# Altium project Main Board.PrjPcb
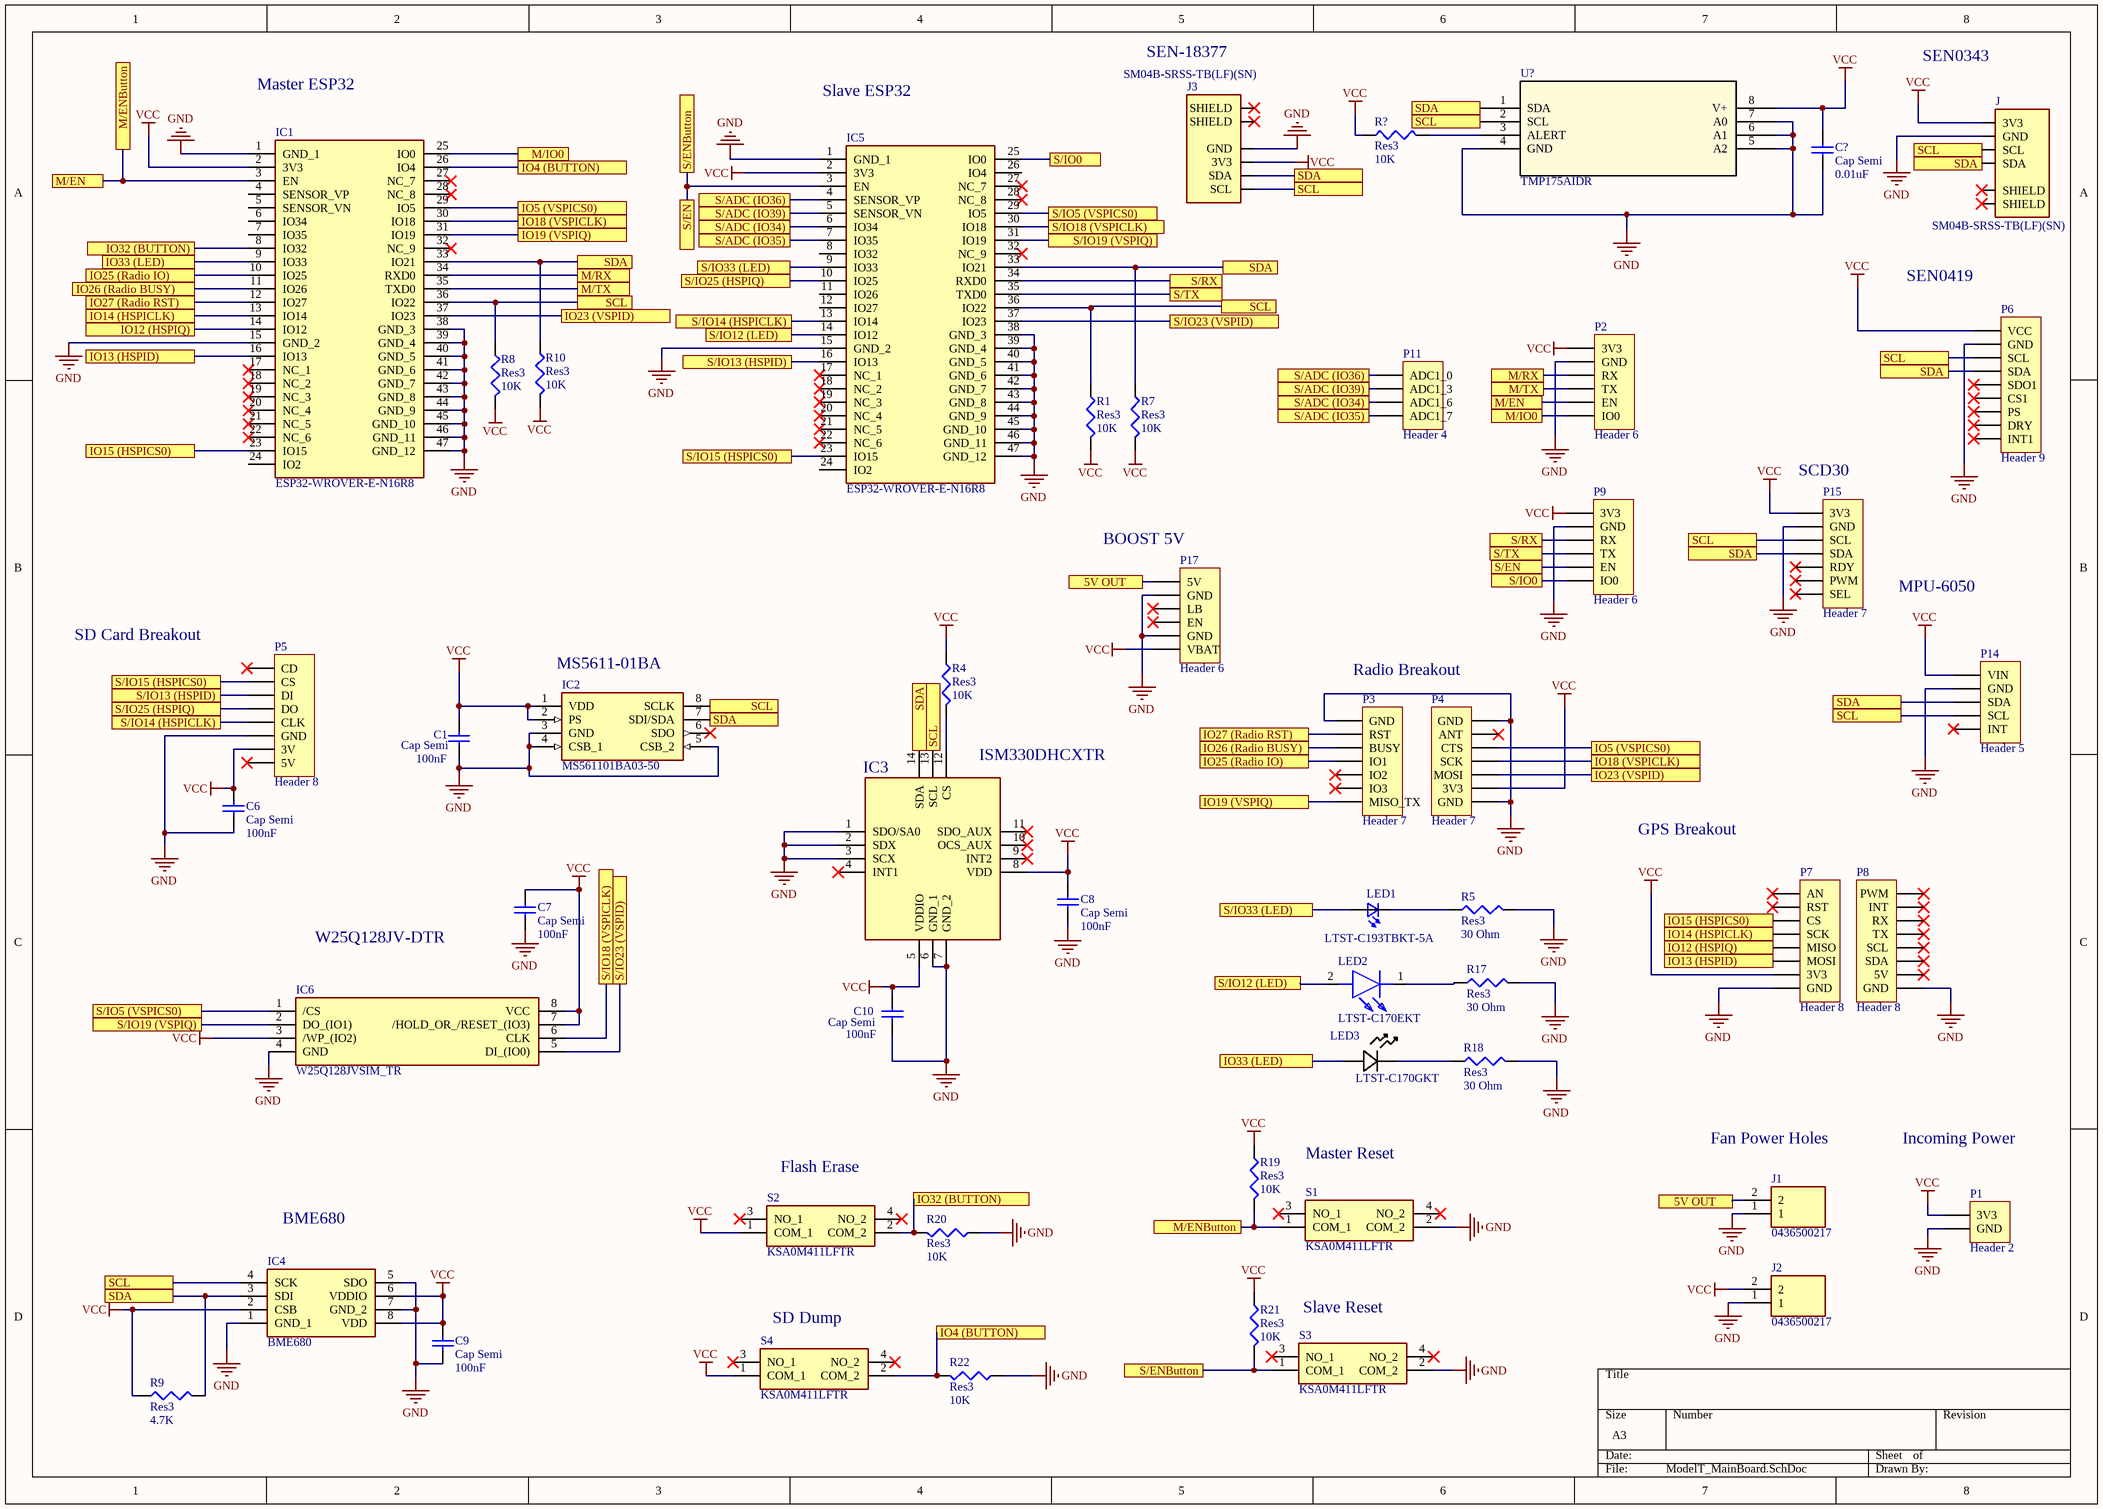
[diagram p0: ModelT_MainBoard.SchDoc]
1 sheet, 52 parts. Net scope: flat (ports and power ports of the same name join across sheets).
Board file: Main Board.PcbDoc

## Sheet ModelT_MainBoard.SchDoc
size A3; SheetNumber: 1; SheetTotal: 1

### Parts
C1  Cap Semi  value 100nF  [C1206]
C2  Cap Semi  value 0.01uF  [C1206]
C6  Cap Semi  value 100nF  [C1206]
C7  Cap Semi  value 100nF  [C1206]
C8  Cap Semi  value 100nF  [C1206]
C9  Cap Semi  value 100nF  [C1206]
C10  Cap Semi  value 100nF  [C1206]
IC1  ESP32-WROVER-E-N16R8  [ESP32WROVEREN16R8]
IC2  MS561101BA03-50  [MS561101BA03-50]
IC3  ISM330DHCXTR  [LGA-14(2.5X3X0.86)]
IC4  BME680  [BME680]
IC5  ESP32-WROVER-E-N16R8  [ESP32WROVEREN16R8]
IC6  W25Q128JVSIM_TR  [SOIC127P790X216-8N]
J  SM04B-SRSS-TB(LF)(SN)  [JST_SM04B-SRSS-TB(LF)(SN)]
J1  0436500217  [0436500217]
J2  0436500217  [0436500217]
J3  SM04B-SRSS-TB(LF)(SN)  [JST_SM04B-SRSS-TB(LF)(SN)]
LED1  LTST-C193TBKT-5A  [0603]
LED2  LTST-C170EKT  [LEDC2012X120N]
LED3  LTST-C170GKT  [LED_LTST-C170GKT_LTO]
P1  Header 2  [HDR1X2]
P2  Header 6  [HDR1X6]
P3  Header 7  [HDR1X7]
P4  Header 7  [HDR1X7]
P5  Header 8  [HDR1X8]
P6  Header 9  [HDR1X9]
P7  Header 8  [HDR1X8]
P8  Header 8  [HDR1X8]
P9  Header 6  [HDR1X6]
P11  Header 4  [HDR1X4]
P14  Header 5  [HDR1X5]
P15  Header 7  [RHDR7W76P0X254_1X7_1778X356X864P]
P17  Header 6  [HDR1X6]
R1  Res3  value 10K  [J1-0603]
R2  Res3  value 10K  [J1-0603]
R4  Res3  value 10K  [J1-0603]
R5  Res3  value 30 Ohm  [J1-0603]
R7  Res3  value 10K  [J1-0603]
R8  Res3  value 10K  [J1-0603]
R9  Res3  value 4.7K  [J1-0603]
R10  Res3  value 10K  [J1-0603]
R17  Res3  value 30 Ohm  [J1-0603]
R18  Res3  value 30 Ohm  [J1-0603]
R19  Res3  value 10K  [J1-0603]
R20  Res3  value 10K  [J1-0603]
R21  Res3  value 10K  [J1-0603]
R22  Res3  value 10K  [J1-0603]
S1  KSA0M411LFTR  [KSA0M411LFTR]
S2  KSA0M411LFTR  [KSA0M411LFTR]
S3  KSA0M411LFTR  [KSA0M411LFTR]
S4  KSA0M411LFTR  [KSA0M411LFTR]
U1  TMP175AIDR  [D8]

### Ports
5V OUT, IO4 (BUTTON), IO5 (VSPICS0), IO12 (HSPIQ), IO13 (HSPID), IO14 (HSPICLK), IO15 (HSPICS0), IO18 (VSPICLK), IO19 (VSPIQ), IO23 (VSPID), IO25 (Radio IO), IO26 (Radio BUSY), IO27 (Radio RST), IO32 (BUTTON), IO33 (LED), M/EN, M/ENButton, M/IO0, M/RX, M/TX, S/ADC (IO34), S/ADC (IO35), S/ADC (IO36), S/ADC (IO39), S/EN, S/ENButton, S/IO0, S/IO5 (VSPICS0), S/IO12 (LED), S/IO13 (HSPID), S/IO14 (HSPICLK), S/IO15 (HSPICS0), S/IO18 (VSPICLK), S/IO19 (VSPIQ), S/IO23 (VSPID), S/IO25 (HSPIQ), S/IO33 (LED), S/RX, S/TX, SCL, SDA

### Nets
GND: C1.1 C2.1 C6.1 C7.1 C8.1 C9.1 C10.1 IC1.1(GND_1) IC1.15(GND_2) IC1.38(GND_3) IC1.39(GND_4) IC1.40(GND_5) IC1.41(GND_6) IC1.42(GND_7) IC1.43(GND_8) IC1.44(GND_9) IC1.45(GND_10) IC1.46(GND_11) IC1.47(GND_12) IC2.3(GND) IC2.4(CSB_1) IC2.5(CSB_2) IC3.1(SDO/SA0) IC3.2(SDX) IC3.3(SCX) IC3.6(GND_1) IC3.7(GND_2) IC4.1(GND_1) IC4.5(SDO) IC4.7(GND_2) IC5.1(GND_1) IC5.15(GND_2) IC5.38(GND_3) IC5.39(GND_4) IC5.40(GND_5) IC5.41(GND_6) IC5.42(GND_7) IC5.43(GND_8) IC5.44(GND_9) IC5.45(GND_10) IC5.46(GND_11) IC5.47(GND_12) IC6.4(GND) J.2(GND) J1.1 J2.1 J3.4(GND) P1.2(GND) P2.2(GND) P3.1(GND) P4.1(GND) P4.7(GND) P5.6(GND) P6.2(GND) P7.8(GND) P8.1(GND) P9.2(GND) P14.2(GND) P15.2(GND) P17.2(GND) P17.5(GND) R5.2 R17.2 R18.2 R20.1 R22.1 S1.2(COM_2) S3.2(COM_2) U1.4(GND) U1.5(A2) U1.6(A1) U1.7(A0)
VCC: C1.2 C2.2 C6.2 C7.2 C8.2 C9.2 C10.2 IC1.2(3V3) IC2.1(VDD) IC2.2(PS) IC3.5(VDDIO) IC3.8(VDD) IC4.2(CSB) IC4.6(VDDIO) IC4.8(VDD) IC5.2(3V3) IC6.3(/WP_(IO2)) IC6.7(/HOLD_OR_/RESET_(IO3)) IC6.8(VCC) J.1(3V3) J2.2 J3.3(3V3) P1.1(3V3) P2.1(3V3) P4.2(3V3) P5.7(3V) P6.1(VCC) P7.7(3V3) P9.1(3V3) P14.1(VIN) P15.1(3V3) P17.6(VBAT) R1.2 R2.1 R4.1 R7.2 R8.2 R9.1 R10.2 R19.1 R21.1 S2.1(COM_1) S4.1(COM_1) U1.8(V+)
NetIC1_3: IC1.3(EN) P2.5(EN) R19.2 S1.1(COM_1) ; port M/ENButton, port M/EN
NetIC1_8: IC1.8(IO32) R20.2 S2.2(COM_2) ; port IO32 (BUTTON)
NetIC1_9: IC1.9(IO33) LED3.2 ; port IO33 (LED)
NetIC1_10: IC1.10(IO25) P3.4(IO1) ; port IO25 (Radio IO)
NetIC1_11: IC1.11(IO26) P3.3(BUSY) ; port IO26 (Radio BUSY)
NetIC1_12: IC1.12(IO27) P3.2(RST) ; port IO27 (Radio RST)
NetIC1_13: IC1.13(IO14) P7.4(SCK) ; port IO14 (HSPICLK)
NetIC1_14: IC1.14(IO12) P7.5(MISO) ; port IO12 (HSPIQ)
NetIC1_16: IC1.16(IO13) P7.6(MOSI) ; port IO13 (HSPID)
NetIC1_23: IC1.23(IO15) P7.3(CS) ; port IO15 (HSPICS0)
NetIC1_25: IC1.25(IO0) P2.6(IO0) ; port M/IO0
NetIC1_26: IC1.26(IO4) R22.2 S4.2(COM_2) ; port IO4 (BUTTON)
NetIC1_29: IC1.29(IO5) P4.5(CTS) ; port IO5 (VSPICS0)
NetIC1_30: IC1.30(IO18) P4.4(SCK) ; port IO18 (VSPICLK)
NetIC1_31: IC1.31(IO19) P3.7(MISO_TX) ; port IO19 (VSPIQ)
NetIC1_33: IC1.33(IO21) IC2.7(SDI/SDA) IC3.14(SDA) IC4.3(SDI) IC5.33(IO21) J.4(SDA) J3.2(SDA) P6.4(SDA) P14.3(SDA) P15.4(SDA) R7.1 R9.2 R10.1 U1.1(SDA) ; port SDA
NetIC1_34: IC1.34(RXD0) P2.3(RX) ; port M/RX
NetIC1_35: IC1.35(TXD0) P2.4(TX) ; port M/TX
NetIC1_36: IC1.36(IO22) IC2.8(SCLK) IC3.13(SCL) IC4.4(SCK) IC5.36(IO22) J.3(SCL) J3.1(SCL) P6.3(SCL) P14.4(SCL) P15.3(SCL) R1.1 R8.1 U1.2(SCL) ; port SCL
NetIC1_37: IC1.37(IO23) P4.3(MOSI) ; port IO23 (VSPID)
NetIC3_12: IC3.12(CS) R4.2
NetIC5_3: IC5.3(EN) P9.5(EN) R21.2 S3.1(COM_1) ; port S/EN, port S/ENButton
NetIC5_4: IC5.4(SENSOR_VP) P11.1(ADC1_0) ; port S/ADC (IO36)
NetIC5_5: IC5.5(SENSOR_VN) P11.2(ADC1_3) ; port S/ADC (IO39)
NetIC5_6: IC5.6(IO34) P11.3(ADC1_6) ; port S/ADC (IO34)
NetIC5_7: IC5.7(IO35) P11.4(ADC1_7) ; port S/ADC (IO35)
NetIC5_9: IC5.9(IO33) LED1.2(A2) ; port S/IO33 (LED)
NetIC5_10: IC5.10(IO25) P5.4(DO) ; port S/IO25 (HSPIQ)
NetIC5_13: IC5.13(IO14) P5.5(CLK) ; port S/IO14 (HSPICLK)
NetIC5_14: IC5.14(IO12) LED2.2(A) ; port S/IO12 (LED)
NetIC5_16: IC5.16(IO13) P5.3(DI) ; port S/IO13 (HSPID)
NetIC5_23: IC5.23(IO15) P5.2(CS) ; port S/IO15 (HSPICS0)
NetIC5_25: IC5.25(IO0) P9.6(IO0) ; port S/IO0
NetIC5_29: IC5.29(IO5) IC6.1(/CS) ; port S/IO5 (VSPICS0)
NetIC5_30: IC5.30(IO18) IC6.6(CLK) ; port S/IO18 (VSPICLK)
NetIC5_31: IC5.31(IO19) IC6.2(DO_(IO1)) ; port S/IO19 (VSPIQ)
NetIC5_34: IC5.34(RXD0) P9.3(RX) ; port S/RX
NetIC5_35: IC5.35(TXD0) P9.4(TX) ; port S/TX
NetIC5_37: IC5.37(IO23) IC6.5(DI_(IO0)) ; port S/IO23 (VSPID)
NetJ1_2: J1.2 P17.1(5V) ; port 5V OUT
NetLED1_1: LED1.1(K2) R5.1
NetLED2_1: LED2.1(K) R17.1
NetLED3_1: LED3.1 R18.1
NetR2_2: R2.2 U1.3(ALERT)

Not connected (* = marked no-connect by the designer): IC1 4(SENSOR_VP) 5(SENSOR_VN) 6(IO34) 7(IO35) 17(NC_1)* 18(NC_2)* 19(NC_3)* 20(NC_4)* 21(NC_5)* 22(NC_6)* 24(IO2) 27(NC_7)* 28(NC_8)* 32(NC_9)*; IC2 6(SDO)*; IC3 4(INT1)* 9(INT2)* 10(OCS_AUX)* 11(SDO_AUX)*; IC5 8(IO32) 11(IO26) 12(IO27) 17(NC_1)* 18(NC_2)* 19(NC_3)* 20(NC_4)* 21(NC_5)* 22(NC_6)* 24(IO2) 26(IO4) 27(NC_7)* 28(NC_8)* 32(NC_9)*; J S1(SHIELD)* S2(SHIELD)*; J3 S1(SHIELD)* S2(SHIELD)*; P3 5(IO2)* 6(IO3)*; P4 6(ANT)*; P5 1(CD)* 8(5V)*; P6 5(SDO1)* 6(CS1)* 7(PS)* 8(DRY)* 9(INT1)*; P7 1(AN)* 2(RST)*; P8 2(5V)* 3(SDA)* 4(SCL)* 5(TX)* 6(RX)* 7(INT)* 8(PWM)*; P14 5(INT)*; P15 5(RDY)* 6(PWM)* 7(SEL)*; P17 3(LB)* 4(EN)*; S1 3(NO_1)* 4(NO_2)*; S2 3(NO_1)* 4(NO_2)*; S3 3(NO_1)* 4(NO_2)*; S4 3(NO_1)* 4(NO_2)*

### Notes on the sheet
- Master ESP32
- Slave ESP32
- (near J3) SEN-18377
- SEN0343
- SEN0419
- (near P15) SCD30
- (near P17) BOOST 5V
- SD Card Breakout
- MPU-6050
- (near IC2) MS5611-01BA
- Radio Breakout
- GPS Breakout
- W25Q128JV-DTR
- (near S2) Flash Erase
- Master Reset
- (near J1) Fan Power Holes
- Incoming Power
- BME680
- (near S4) SD Dump
- Slave Reset

### Library data of the parts
C1 C2 C6-C10 = Cap Semi: Capacitor (Semiconductor SIM Model); Published: 8-Jun-2000; LatestRevisionDate: 29-May-2009; LatestRevisionNote: IPC-7351 Footprint Added.; PackageReference: C1206; Publisher: Altium Limited; PackageDescription: Chip Capacitor
IC1 IC5 = ESP32-WROVER-E-N16R8: Integrated Circuit; Manufacturer_Name: Espressif Systems; Datasheet Link: https://www.espressif.com/sites/default/files/documentation/esp32-wrover-e_esp32-wrover-ie_datasheet_en.pdf; Height: 3.45mm; Manufacturer_Part_Number: ESP32-WROVER-E-N16R8; Mouser Part Number: 356-ESP32WRVE22864PC; Mouser Price/Stock: https://www.mouser.co.uk/ProductDetail/Espressif-Systems/ESP32-WROVER-E-N16R8?qs=Li%252BoUPsLEnsfUZ%252By2eNF6g%3D%3D
IC2 = MS561101BA03-50: Integrated Circuit; Manufacturer_Name: TE Connectivity; Datasheet Link: http://www.te.com/usa-en/search.html?q=ms5611&source=header; Manufacturer_Part_Number: MS561101BA03-50; Mouser Part Number: 824-MS561101BA03-50; Mouser Price/Stock: https://www.mouser.co.uk/ProductDetail/Measurement-Specialties/MS561101BA03-50?qs=%252BgKeJhng5iV%252BnCz6Qd5iDw%3D%3D; Arrow Part Number: MS561101BA03-50; Arrow Price/Stock: https://www.arrow.com/en/products/ms561101ba03-50/te-connectivity?region=europe
IC3 = ISM330DHCXTR: Integrated Circuit; Manufacturer_Name: STMicroelectronics; Datasheet Link: https://www.st.com/resource/en/datasheet/ism330dhcx.pdf; Manufacturer_Part_Number: ISM330DHCXTR; Mouser Part Number: 511-ISM330DHCXTR; Mouser Price/Stock: https://www.mouser.co.uk/ProductDetail/STMicroelectronics/ISM330DHCXTR?qs=%252B6g0mu59x7Jv2Xps2dM6Xw%3D%3D; Arrow Part Number: ISM330DHCXTR; Arrow Price/Stock: https://www.arrow.com/en/products/ism330dhcxtr/stmicroelectronics?region=nac
IC4 = BME680: Integrated Circuit; Manufacturer_Name: Bosch Sensortec; Datasheet Link: https://datasheet.datasheetarchive.com/originals/distributors/DKDS-24/462907.pdf; Manufacturer_Part_Number: BME680; Mouser Part Number: 262-BME680; Mouser Price/Stock: https://www.mouser.co.uk/ProductDetail/Bosch-Sensortec/BME680?qs=v271MhAjFHjo0yA%2FC4OnDQ%3D%3D; Arrow Part Number: BME680; Arrow Price/Stock: https://www.arrow.com/en/products/bme680/bosch?region=nac
IC6 = W25Q128JVSIM_TR: Integrated Circuit; Manufacturer_Name: Winbond; Manufacturer_Part_Number: W25Q128JVSIM TR; Datasheet Link: http://www.winbond.com/resource-files/w25q128jv%20dtr%20revb%2011042016.pdf; Height: 2.16mm; Mouser Part Number: 454-W25Q128JVSIMTR; Mouser Price/Stock: https://www.mouser.co.uk/ProductDetail/Winbond/W25Q128JVSIM-TR?qs=qSfuJ%252Bfl%2Fd6ji9IuruL6Zg%3D%3D; Arrow Part Number: W25Q128JVSIM TR; Arrow Price/Stock: https://www.arrow.com/en/products/w25q128jvsimtr/winbond-electronics?region=nac
J J3 = SM04B-SRSS-TB(LF)(SN): Connector Header Surface Mount, Right Angle 4 position 0.039 _1.00mm_; MF: JST Sales; MP: SM04B-SRSS-TB_LF__SN_; Price: None; SnapEDA_Link: https://www.snapeda.com/parts/SM04B-SRSS-TB%28LF%29%28SN%29/JST%20Sales%20America%20Inc./view-part/557466/?ref=snap; Value: *; Availability: Unavailable; Package: None
J1 J2 = 0436500217: Connector; Manufacturer_Name: Molex; Datasheet Link: https://datasheet.datasheetarchive.com/originals/distributors/Datasheets-DGA21/2145585.pdf; Height: 9.9mm; Manufacturer_Part_Number: 0436500217; Mouser Part Number: N/A; Mouser Price/Stock: https://www.mouser.co.uk/ProductDetail/Molex/0436500217?qs=%252BdQmOuGyFcG%2F6znKEq1cuQ%3D%3D; Arrow Part Number: 0436500217; Arrow Price/Stock: https://www.arrow.com/en/products/0436500217/molex
LED1 = LTST-C193TBKT-5A: Blue 470nm LED Indication - Discrete 2.8V 0603 _1608 Metric_; MF: Lite-On Inc.; MP: LTST-C193TBKT-5A; Value: *; Digi-Key_Purchase_URL: https://www.digikey.com/product-detail/en/lite-on-inc/LTST-C193TBKT-5A/160-1827-1-ND/2355044?utm_source=snapeda&utm_medium=aggregator&utm_campaign=symbol; SnapEDA_Link: https://www.snapeda.com/parts/LTST-C193TBKT-5A/Lite-On%20Inc./view-part/350303/?ref=snap; Digi-Key_Part_Number: 160-1827-1-ND; Package: 0603 Lite-On
LED2 = LTST-C170EKT: LED; Manufacturer_Name: Lite-On; Datasheet Link: https://media.digikey.com/pdf/Data%20Sheets/Lite-On%20PDFs/LTST-C170EKT.pdf; Height: 1.2mm; Manufacturer_Part_Number: LTST-C170EKT; Mouser Part Number: 859-LTST-C170EKT; Mouser Price/Stock: https://www.mouser.co.uk/ProductDetail/Lite-On/LTST-C170EKT?qs=0hBTvMLoVZ04yIRvO1DUlw%3D%3D; Arrow Part Number: LTST-C170EKT; Arrow Price/Stock: https://www.arrow.com/en/products/ltst-c170ekt/lite-on-technology
LED3 = LTST-C170GKT: No Description Available; Mfr_Name: LITE-ON; Type: DEV; Copyright: Copyright (C) 2022 Ultra Librarian. All rights reserved.; Manufacturer_Part_Number: LTST-C170GKT; Digi-Key_Part_Number_1: 160-1179-2-ND; Digi-Key_Part_Number_2: 160-1179-1-ND; Digi-Key_Part_Number_3: 160-1179-6-ND; RefDes: RefDes
P1 = Header 2: Header, 2-Pin; LatestRevisionDate: 17-Jul-2002; LatestRevisionNote: Re-released for DXP Platform.; Publisher: Altium Limited
P2 P9 P17 = Header 6: Header, 6-Pin; LatestRevisionDate: 17-Jul-2002; LatestRevisionNote: Re-released for DXP Platform.; Publisher: Altium Limited
P3 P4 P15 = Header 7: Header, 7-Pin; LatestRevisionDate: 17-Jul-2002; LatestRevisionNote: Re-released for DXP Platform.; Publisher: Altium Limited
P5 P7 P8 = Header 8: Header, 8-Pin; LatestRevisionDate: 17-Jul-2002; LatestRevisionNote: Re-released for DXP Platform.; Publisher: Altium Limited
P6 = Header 9: Header, 9-Pin; LatestRevisionDate: 17-Jul-2002; LatestRevisionNote: Re-released for DXP Platform.; Publisher: Altium Limited
P11 = Header 4: Header, 4-Pin; LatestRevisionDate: 17-Jul-2002; LatestRevisionNote: Re-released for DXP Platform.; Publisher: Altium Limited
P14 = Header 5: Header, 5-Pin; LatestRevisionDate: 17-Jul-2002; LatestRevisionNote: Re-released for DXP Platform.; Publisher: Altium Limited
R1 R2 R4 R5 R7-R10 R17-R22 = Res3: Resistor; Published: 8-Jun-2000; LatestRevisionDate: 29-May-2009; LatestRevisionNote: IPC-7351 Footprint Added.; PackageReference: J1-0603; Publisher: Altium Limited; PackageDescription: Chip Resistor
S1-S4 = KSA0M411LFTR: Switch; Manufacturer_Name: C & K COMPONENTS; Datasheet Link: https://www.ckswitches.com/media/1457/ksa_ksl.pdf; Height: 4.9mm; Manufacturer_Part_Number: KSA0M411LFTR
U1 = TMP175AIDR: No Description Available; Mfr_Name: Texas Instruments; Copyright: Copyright (C) 2022 Ultra Librarian. All rights reserved.; Manufacturer_Part_Number: TMP175AIDR; Digi-Key_Part_Number_1: 296-17837-1-ND; Digi-Key_Part_Number_2: 296-17837-2-ND; Digi-Key_Part_Number_3: 296-17837-6-ND; Digi-Key_Part_Number_4: 2156-TMP175AIDR-ND; RefDes: RefDes; Type: DEV